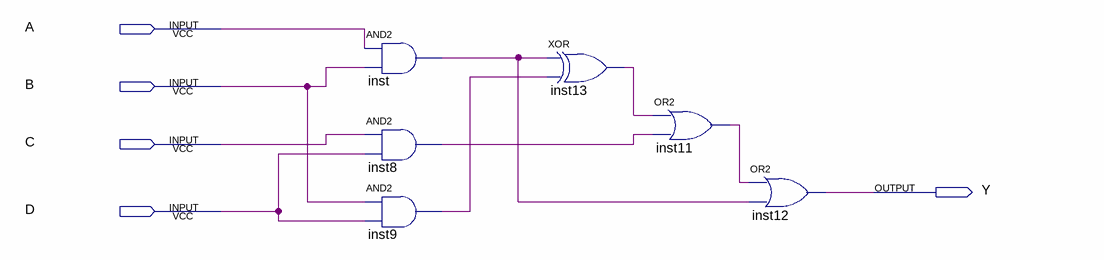
[diagram p0: schematic sheet]
// Quartus schematic Laba1.bdf as structural Verilog: 6 symbols, 5 pins
module Laba1 (
  input  A,
  input  B,
  input  C,
  input  D,
  output Y
);

  wire inst8_out, inst9_out, inst11_out, inst13_out, inst_out;

  and inst (inst_out, A, B);
  and inst8 (inst8_out, C, D);
  and inst9 (inst9_out, B, D);
  xor inst13 (inst13_out, inst_out, inst9_out);
  or inst11 (inst11_out, inst13_out, inst8_out);
  or inst12 (Y, inst11_out, inst_out);
endmodule
